# Altium schematic sheet HUB_Sheet2.SchDoc
size A4
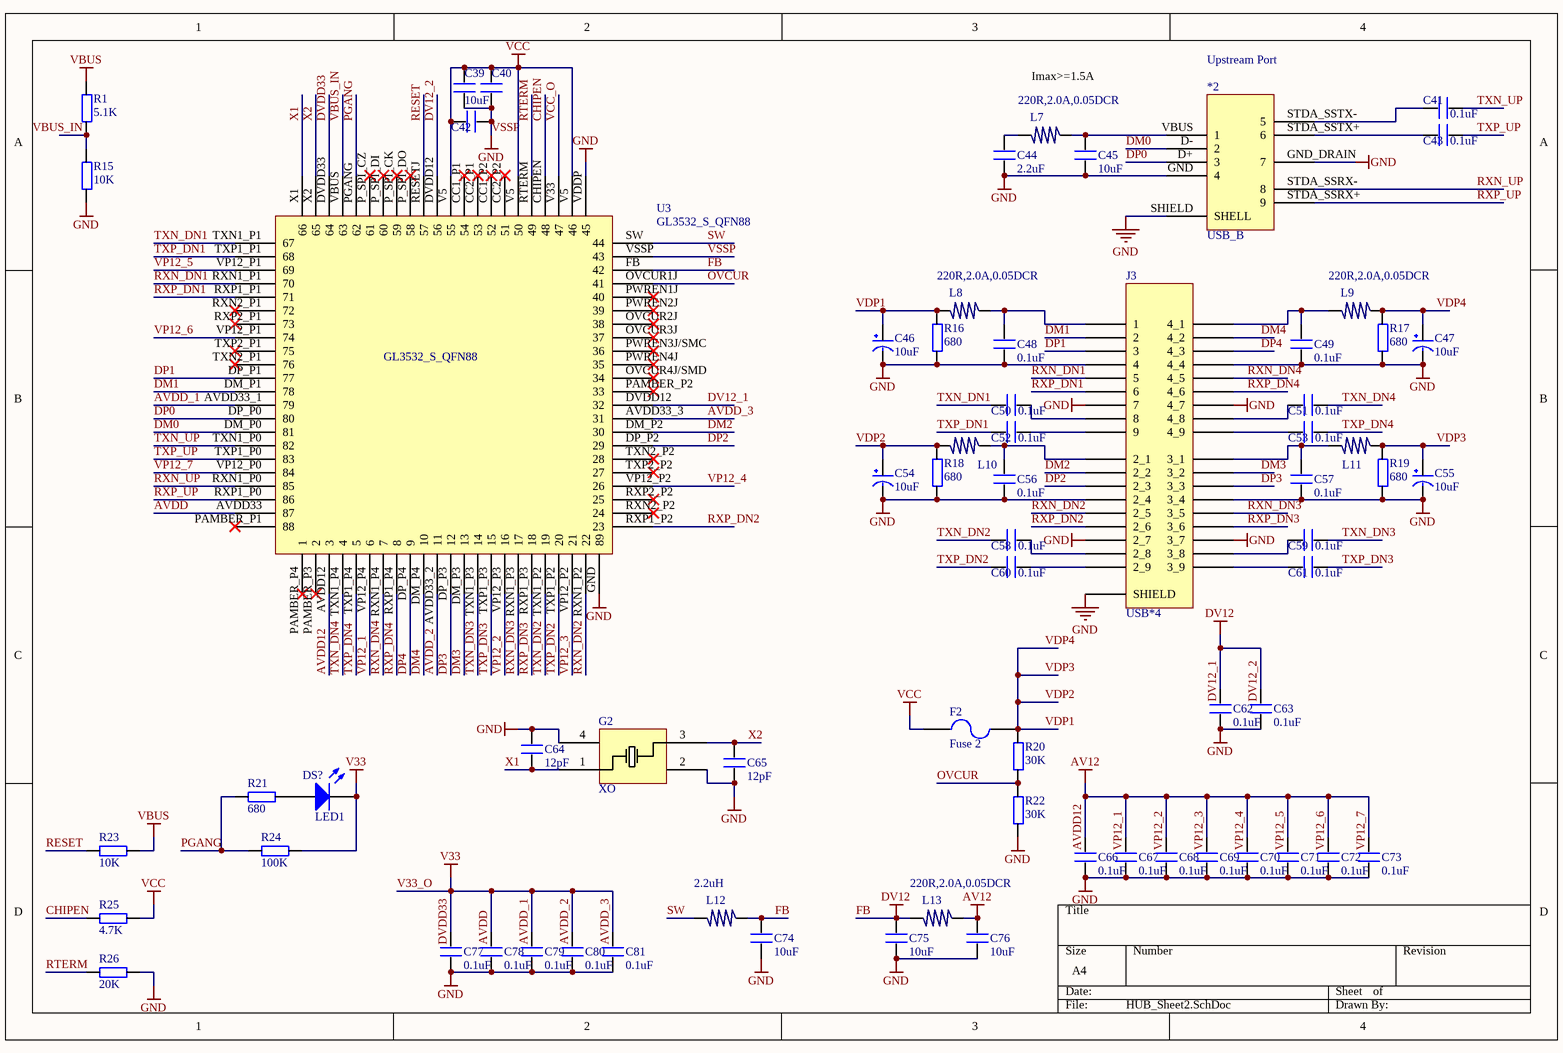
[diagram p0: HUB_Sheet2.SchDoc]

## Parts
*2  USB_B
C39  10uF  [0603P]
C40  10uF  [0603P]  (value not drawn)
C41  0.1uF  [0603P]
C42  10uF  [0603P]  (value not drawn)
C43  0.1uF  [0603P]
C44  2.2uF  [0603P]
C45  10uF  [0603P]
C46  10uF  [CC6.56.5]
C47  10uF  [CC6.56.5]
C48  0.1uF  [0603P]
C49  0.1uF  [0603P]
C50  0.1uF  [0603P]
C51  0.1uF  [0603P]
C52  0.1uF  [0603P]
C53  0.1uF  [0603P]
C54  10uF  [CC6.56.5]
C55  10uF  [CC6.56.5]
C56  0.1uF  [0603P]
C57  0.1uF  [0603P]
C58  0.1uF  [0603P]
C59  0.1uF  [0603P]
C60  0.1uF  [0603P]
C61  0.1uF  [0603P]
C62  0.1uF  [0603P]
C63  0.1uF  [0603P]
C64  12pF  [0603P]
C65  12pF  [0603P]
C66  0.1uF  [0603P]
C67  0.1uF  [0603P]
C68  0.1uF  [0603P]
C69  0.1uF  [0603P]
C70  0.1uF  [0603P]
C71  0.1uF  [0603P]
C72  0.1uF  [0603P]
C73  0.1uF  [0603P]
C74  10uF  [0603P]
C75  10uF  [0603P]
C76  10uF  [0603P]
C77  0.1uF  [0603P]
C78  0.1uF  [0603P]
C79  0.1uF  [0603P]
C80  0.1uF  [0603P]
C81  0.1uF  [0603P]
DS?  LED1  [SMDLED]
F2  Fuse 2  [PIN-W2/E2.8]
G2  XO
J3  USB*4
L7  220R,2.0A,0.05DCR  [0603P]
L8  220R,2.0A,0.05DCR  [0603P]
L9  220R,2.0A,0.05DCR  [0603P]
L10  220R,2.0A,0.05DCR  [0603P]  (value not drawn)
L11  220R,2.0A,0.05DCR  [0603P]  (value not drawn)
L12  2.2uH  [0603P]
L13  220R,2.0A,0.05DCR  [0603P]
R1  5.1K  [0603P]
R15  10K  [0603P]
R16  680  [0603P]
R17  680  [0603P]
R18  680  [0603P]
R19  680  [0603P]
R20  30K  [0603P]
R21  680  [0603P]
R22  30K  [0603P]
R23  10K  [0603P]
R24  100K  [0603P]
R25  4.7K  [0603P]
R26  20K  [0603P]
U3  GL3532_S_QFN88  [GL3532_S_QFN88]

## Nets
AV12: C66.2 C67.2 C68.2 C69.2 C70.2 C71.2 C72.2 C73.2 C76.2 L13.1
FB: C62.2 C63.2 C74.2 C75.2 L12.1 L13.2 U3.FB(42)  [also labelled DV12]
V33_O: C77.2 C78.2 C79.2 C80.2 C81.2 DS?.2(K) R24.2  [also labelled V33]
VBUS: R1.2 R23.2
VCC: C39.2 C40.2 C42.1 F2.1 R25.2 U3.V5(46)
VSSP: *2.GND(4) *2.GND_DRAIN(7) *2.SHIELD(SHELL) C39.1 C40.1 C42.2 C44.1 C45.1 C46.2(GND) C47.2(GND) C48.1 C49.1 C54.2(GND) C55.2(GND) C56.1 C57.1 C62.1 C63.1 C64.2 C65.1 C66.1 C67.1 C68.1 C69.1 C70.1 C71.1 C72.1 C73.1 C74.1 C75.1 C76.1 C77.1 C78.1 C79.1 C80.1 C81.1 G2.2 G2.4 J3.?4(4) J3.?7(7) J3.?13(2_4) J3.?16(2_7) J3.?22(4_4) J3.?25(4_7) J3.?31(3_4) J3.?34(3_7) J3.?37(SHIELD) R15.1 R16.1 R17.1 R18.1 R19.1 R22.1 R26.2 U3.GND(89) U3.VDDP(45) U3.VSSP(43)  [also labelled GND]
AVDD: U3.AVDD33(87)
AVDD12: U3.AVDD12(3)
AVDD_1: U3.AVDD33_1(79)
AVDD_2: U3.AVDD33_2(11)
AVDD_3: U3.AVDD33_3(31)
CHIPEN: R25.1 U3.CHIPEN(48)
DM0: *2.D-(2) U3.DM_P0(81)
DM1: J3.?2(2) U3.DM_P1(78)
DM2: J3.?11(2_2) U3.DM_P2(30)
DM3: J3.?29(3_2) U3.DM_P3(13)
DM4: J3.?20(4_2) U3.DM_P4(10)
DP0: *2.D+(3) U3.DP_P0(80)
DP1: J3.?3(3) U3.DP_P1(77)
DP2: J3.?12(2_3) U3.DP_P2(29)
DP3: J3.?30(3_3) U3.DP_P3(12)
DP4: J3.?21(4_3) U3.DP_P4(9)
DV12_1: U3.DVDD12(32)
DV12_2: U3.DVDD12(56)
DVDD33: U3.DVDD33(64)
OVCUR: R20.1 R22.2 U3.OVCUR1J(41)
PGANG: R21.1 R24.1 U3.PGANG(62)
RESET: R23.1 U3.RESETJ(57)
RTERM: R26.1 U3.RTERM(49)
RXN_DN1: J3.?5(5) U3.RXN1_P1(70)
RXN_DN2: J3.?14(2_5) U3.RXN1_P2(22)
RXN_DN3: J3.?32(3_5) U3.RXN1_P3(17)
RXN_DN4: J3.?23(4_5) U3.RXN1_P4(7)
RXN_UP: *2.STDA_SSRX-(8) U3.RXN1_P0(85)
RXP_DN1: J3.?6(6) U3.RXP1_P1(71)
RXP_DN2: J3.?15(2_6) U3.RXP1_P2(23)
RXP_DN3: J3.?33(3_6) U3.RXP1_P3(18)
RXP_DN4: J3.?24(4_6) U3.RXP1_P4(8)
RXP_UP: *2.STDA_SSRX+(9) U3.RXP1_P0(86)
SW: L12.2 U3.SW(44)
TXN_DN1: C50.1 U3.TXN1_P1(67)
TXN_DN2: C58.1 U3.TXN1_P2(19)
TXN_DN3: C59.2 U3.TXN1_P3(14)
TXN_DN4: C51.2 U3.TXN1_P4(4)
TXN_UP: C41.2 U3.TXN1_P0(82)
TXP_DN1: C52.1 U3.TXP1_P1(68)
TXP_DN2: C60.1 U3.TXP1_P2(20)
TXP_DN3: C61.2 U3.TXP1_P3(15)
TXP_DN4: C53.2 U3.TXP1_P4(5)
TXP_UP: C43.2 U3.TXP1_P0(83)
VBUS_IN: U3.VBUS(63)
VCC_O: U3.V33(47)
VDP1: C46.1(VCC) C47.1(VCC) C54.1(VCC) C55.1(VCC) F2.2 L8.2 L9.1 L10.2 L11.1 R16.2 R17.2 R18.2 R19.2 R20.2  [also labelled VDP2, VDP3, VDP4]
VP12_1: U3.VP12_P4(6)
VP12_2: U3.VP12_P3(16)
VP12_3: U3.VP12_P2(21)
VP12_4: U3.VP12_P2(26)
VP12_5: U3.VP12_P1(69)
VP12_6: U3.VP12_P1(74)
VP12_7: U3.VP12_P0(84)
X1: C64.1 G2.1 U3.X1(66)
X2: C65.2 G2.3 U3.X2(65)
Net*2_STDA_SSTX+: *2.STDA_SSTX+(6) C43.1
Net*2_STDA_SSTX-: *2.STDA_SSTX-(5) C41.1
Net*2_VBUS: *2.VBUS(1) C45.2 L7.1
NetC44_2: C44.2 L7.2
NetC48_2: C48.2 J3.?1(1) L8.1
NetC49_2: C49.2 J3.?19(4_1) L9.2
NetC50_2: C50.2 J3.?8(8)
NetC51_1: C51.1 J3.?26(4_8)
NetC52_2: C52.2 J3.?9(9)
NetC53_1: C53.1 J3.?27(4_9)
NetC56_2: C56.2 J3.?10(2_1) L10.1
NetC57_2: C57.2 J3.?28(3_1) L11.2
NetC58_2: C58.2 J3.?17(2_8)
NetC59_1: C59.1 J3.?35(3_8)
NetC60_2: C60.2 J3.?18(2_9)
NetC61_1: C61.1 J3.?36(3_9)
NetDS?_1: DS?.1(A) R21.2
NetR1_1: R1.1 R15.2

Not connected (* = marked no-connect by the designer): U3 CC1_P1(54)* CC1_P2(52)* CC2_P1(53)* CC2_P2(51)* OVCUR2J(38)* OVCUR3J(37)* OVCUR4J/SMD(34)* P_SPI_CK(59)* P_SPI_CZ(61)* P_SPI_DI(60)* P_SPI_DO(58)* PAMBER_P1(88)* PAMBER_P2(33)* PAMBER_P3(2)* PAMBER_P4(1)* PWREN1J(40)* PWREN2J(39)* PWREN3J/SMC(36)* PWREN4J(35)* RXN2_P1(72)* RXN2_P2(24)* RXP2_P1(73)* RXP2_P2(25)* TXN2_P1(76)* TXN2_P2(28)* TXP2_P1(75)* TXP2_P2(27)*

## Notes on the sheet
- Imax>=1.5A
- Upstream Port
- Labels drawn without touching a wire or pin: AVDD, AVDD12, AVDD_1, AVDD_2, AVDD_3, DV12_1, DV12_2, DVDD33, VBUS_IN, VP12_1, VP12_2, VP12_3, VP12_4, VP12_5, VP12_6, VP12_7

## Library data of the parts
C39-C45 C48-C53 C56-C81 = C
C46 C47 C54 C55 = CAP
DS? = LED2: Typical RED, GREEN, YELLOW, AMBER GaAs LED; Published: 8-Jun-2000; LatestRevisionDate: 17-Jul-2002; LatestRevisionNote: Re-released for DXP Platform.; PackageDocument: Feb-2002; PackageReference: 3.2X1.6X1.1; Publisher: Altium Limited
F2 = Fuse 2: Fuse; Published: 8-Jun-2000; LatestRevisionDate: 17-Jul-2002; LatestRevisionNote: Re-released for DXP Platform.; PackageReference: PIN-W2/E2.8; Publisher: Altium Limited; PackageDescription: Thru-Hole; 2 Leads
G2 = XO: 25M XO
L7-L13 = L
R1 R15-R26 = R